# EAGLE design Decoder_relay_4bit_REV.0 (EAGLE 9.6.2)
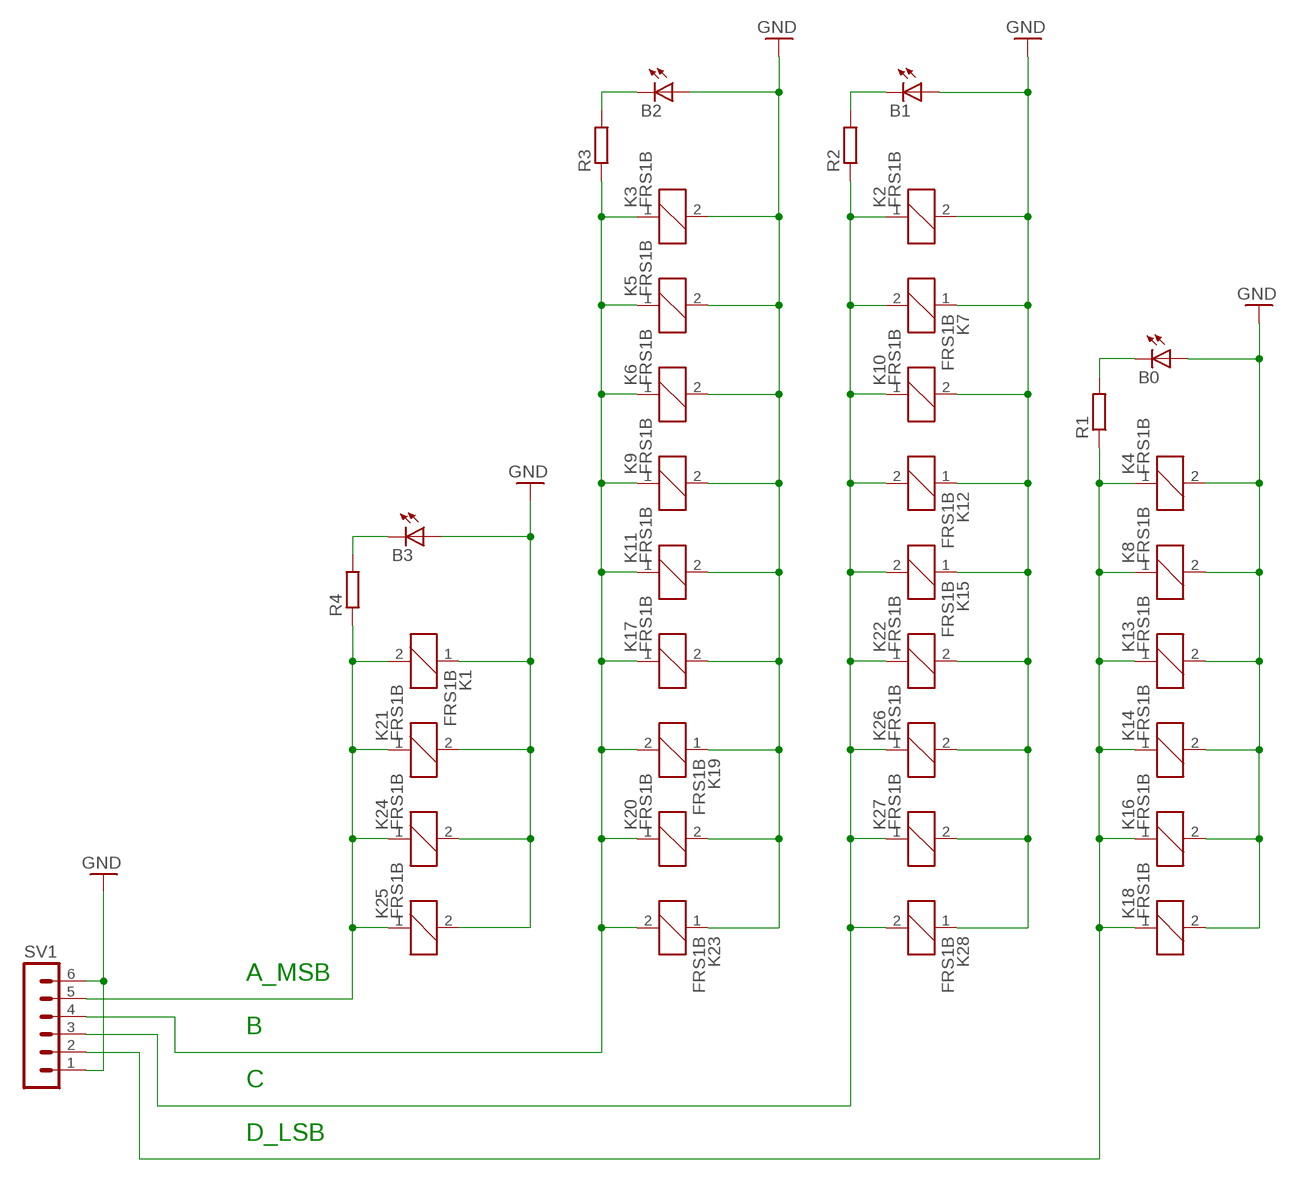
[diagram p0: schematic, sheet 1, part 1 of 2]
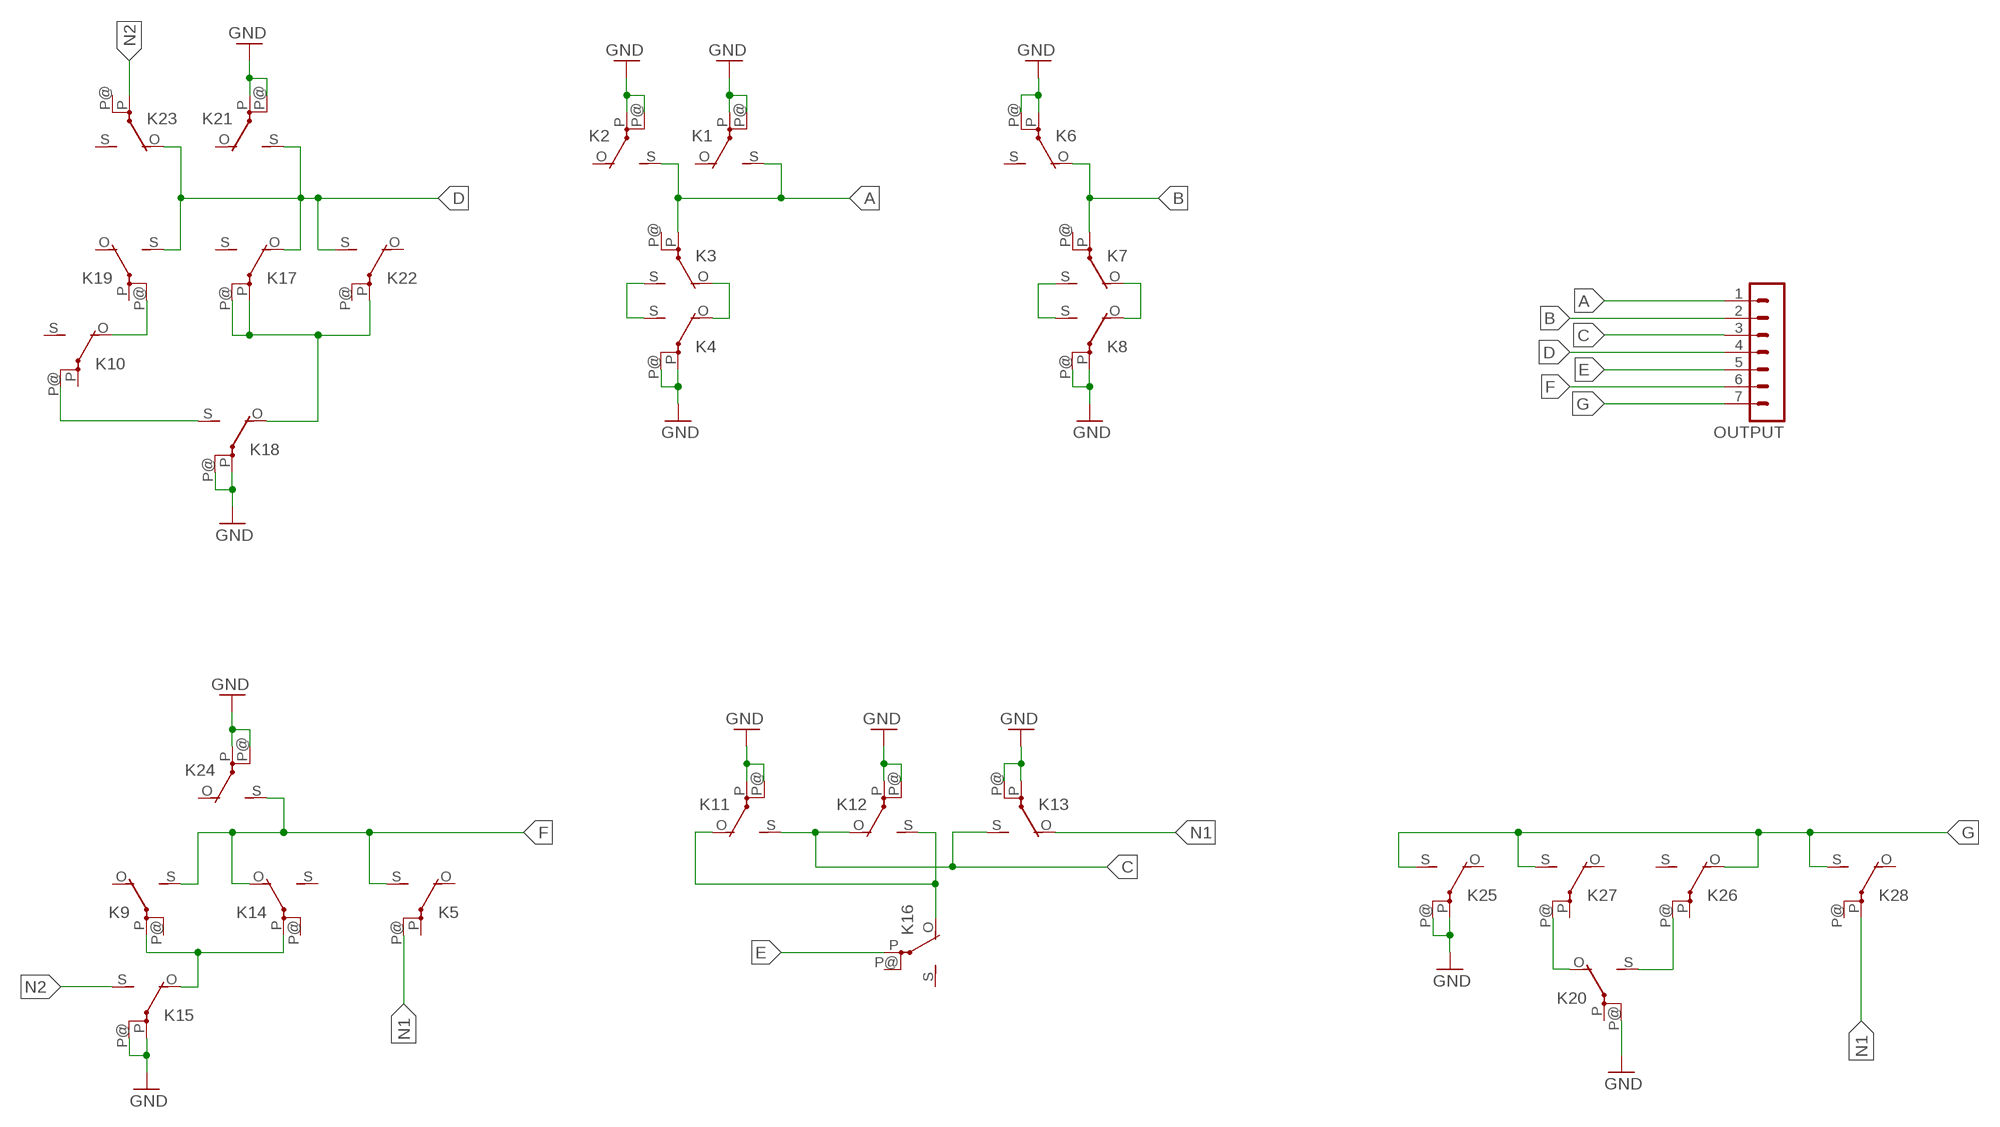
[diagram p1: schematic, sheet 1, part 2 of 2]

## Parts
B0  LED3MM  [LED3MM]
B1  LED3MM  [LED3MM]
B2  LED3MM  [LED3MM]
B3  LED3MM  [LED3MM]
K1  FRS1B  [FRS1B]
K2  FRS1B  [FRS1B]
K3  FRS1B  [FRS1B]
K4  FRS1B  [FRS1B]
K5  FRS1B  [FRS1B]
K6  FRS1B  [FRS1B]
K7  FRS1B  [FRS1B]
K8  FRS1B  [FRS1B]
K9  FRS1B  [FRS1B]
K10  FRS1B  [FRS1B]
K11  FRS1B  [FRS1B]
K12  FRS1B  [FRS1B]
K13  FRS1B  [FRS1B]
K14  FRS1B  [FRS1B]
K15  FRS1B  [FRS1B]
K16  FRS1B  [FRS1B]
K17  FRS1B  [FRS1B]
K18  FRS1B  [FRS1B]
K19  FRS1B  [FRS1B]
K20  FRS1B  [FRS1B]
K21  FRS1B  [FRS1B]
K22  FRS1B  [FRS1B]
K23  FRS1B  [FRS1B]
K24  FRS1B  [FRS1B]
K25  FRS1B  [FRS1B]
K26  FRS1B  [FRS1B]
K27  FRS1B  [FRS1B]
K28  FRS1B  [FRS1B]
OUTPUT  MA07-1  [MA07-1]
R1  R-EU_M1206  [M1206]
R2  R-EU_M1206  [M1206]
R3  R-EU_M1206  [M1206]
R4  R-EU_M1206  [M1206]
SV1  MA06-1  [MA06-1]

## Nets
A: K1.S(2:S) K2.S(2:S) K3.P(2:P) OUTPUT.1
A3: K1.2 K21.1 K24.1 K25.1 R4.1 SV1.5
B: K6.O(2:O) K7.P(2:P) OUTPUT.2
C: K11.S(2:S) K12.O(2:O) K13.S(2:S) OUTPUT.3
D: K17.O(2:O) K19.S(2:S) K21.S(2:S) K22.S(2:S) K23.O(2:O) OUTPUT.4
E: K16.P(2:P) OUTPUT.5
F: K5.S(2:S) K9.S(2:S) K14.O(2:O) K24.S(2:S) OUTPUT.6
G: K25.S(2:S) K26.O(2:O) K27.S(2:S) K28.S(2:S) OUTPUT.7
GND: B0.A B1.A B2.A B3.A K1.1 K1.P(2:P) K1.P@(2:P) K2.2 K2.P(2:P) K2.P@(2:P) K3.2 K4.2 K4.P(2:P) K4.P@(2:P) K5.2 K6.2 K6.P(2:P) K6.P@(2:P) K7.1 K8.2 K8.P(2:P) K8.P@(2:P) K9.2 K10.2 K11.2 K11.P(2:P) K11.P@(2:P) K12.1 K12.P(2:P) K12.P@(2:P) K13.2 K13.P(2:P) K13.P@(2:P) K14.2 K15.1 K15.P(2:P) K15.P@(2:P) K16.2 K17.2 K18.2 K18.P(2:P) K18.P@(2:P) K19.1 K20.2 K20.P@(2:P) K21.2 K21.P(2:P) K21.P@(2:P) K22.2 K23.1 K24.2 K24.P(2:P) K24.P@(2:P) K25.2 K25.P(2:P) K25.P@(2:P) K26.2 K27.2 K28.1 SV1.1 SV1.6
N1: K5.P@(2:P) K13.O(2:O) K28.P(2:P)
N2: K15.S(2:S) K23.P(2:P)
N$2: K17.P(2:P) K17.P@(2:P) K18.O(2:O) K22.P(2:P)
N$3: B0.K(C) R1.2
N$4: K7.S(2:S) K8.S(2:S)
N$5: B1.K(C) R2.2
N$6: K3.S(2:S) K4.S(2:S)
N$8: B2.K(C) R3.2
N$9: B3.K(C) R4.2
N$12: K9.P(2:P) K14.P(2:P) K15.O(2:O)
N$13: K7.O(2:O) K8.O(2:O)
N$15: K20.S(2:S) K26.P@(2:P)
N$16: K20.O(2:O) K27.P@(2:P)
N$17: K10.P@(2:P) K18.S(2:S)
N$19: K10.O(2:O) K19.P@(2:P)
N$26: K3.O(2:O) K4.O(2:O)
N$55: K11.O(2:O) K12.S(2:S) K16.O(2:O)
N$58: K3.1 K5.1 K6.1 K9.1 K11.1 K17.1 K19.2 K20.1 K23.2 R3.1 SV1.4
N$63: K4.1 K8.1 K13.1 K14.1 K16.1 K18.1 R1.1 SV1.2
N$69: K2.1 K7.2 K10.1 K12.2 K15.2 K22.1 K26.1 K27.1 K28.2 R2.1 SV1.3
Unconnected: K1.O(2:O) K2.O(2:O) K3.P@(2:P) K5.O(2:O) K5.P(2:P) K6.S(2:S) K7.P@(2:P) K9.O(2:O) K9.P@(2:P) K10.P(2:P) K10.S(2:S) K14.P@(2:P) K14.S(2:S) K16.P@(2:P) K16.S(2:S) K17.S(2:S) K19.O(2:O) K19.P(2:P) K20.P(2:P) K21.O(2:O) K22.O(2:O) K22.P@(2:P) K23.P@(2:P) K23.S(2:S) K24.O(2:O) K25.O(2:O) K26.P(2:P) K26.S(2:S) K27.O(2:O) K27.P(2:P) K28.O(2:O) K28.P@(2:P)

## Notes on the sheet
- A_MSB
- B
- C
- D_LSB

## Library data of the parts
B0 B1-B3 = led:LED: LED OSRAM: - CHIPLED LG R971, LG N971, LY N971, LG Q971, LY Q971, LO R971, LY R971 LH N974, LH R974 LS Q976, LO Q976, LY Q976 LO Q996 - Hyper CHIPLED LW Q18S LB Q993, LB Q99A, LB R99A - SideLED LS A670, LO A670, LY A670, LG A670, LP A670 LB A673, LV A673, LT A673, LW A673 LH A674 LY A675 LS A676, LA A676, LO A676, LY A676, LW A676 LS A679, LY A679, LG A679 - Hyper Micro SIDELED® LS Y876, LA Y876, LO Y876, LY Y876 LT Y87S - SmartLED LW L88C, LW L88S LB L89C, LB L89S, LG L890 LS L89K, LO L89K, LY L89K LS L896, LA L896, LO L896, LY L896 - TOPLED LS T670, LO T670, LY T670, LG T670, LP T670 LSG T670, LSP T670, LSY T670, LOP T670, LYG T670 LG T671, LOG T671, LSG T671 LB T673, LV T673, LT T673, LW T673 LH T674 LS T676, LA T676, LO T676, LY T676, LB T676, LH T676, LSB T676, LW T676 LB T67C, LV T67C, LT T67C, LS T67K, LO T67K, LY T67K, LW E67C LS E67B, LA E67B, LO E67B, LY E67B, LB E67C, LV E67C, LT E67C LW T67C LS T679, LY T679, LG T679 LS T770, LO T770, LY T770, LG T770, LP T770 LB T773, LV T773, LT T773, LW T773 LH T774 LS E675, LA E675, LY E675, LS T675 LS T776, LA T776, LO T776, LY T776, LB T776 LHGB T686 LT T68C, LB T68C - Hyper Mini TOPLED® LB M676 - Mini TOPLED Santana® LG M470 LS M47K, LO M47K, LY M47K Source: http://www.osram.convergy.de LUXEON: - LUMILED® LXK2-PW12-R00, LXK2-PW12-S00, LXK2-PW14-U00, LXK2-PW14-V00 LXK2-PM12-R00, LXK2-PM12-S00, LXK2-PM14-U00 LXK2-PE12-Q00, LXK2-PE12-R00, LXK2-PE12-S00, LXK2-PE14-T00, LXK2-PE14-U00 LXK2-PB12-K00, LXK2-PB12-L00, LXK2-PB12-M00, LXK2-PB14-N00, LXK2-PB14-P00, LXK2-PB14-Q00 LXK2-PR12-L00, LXK2-PR12-M00, LXK2-PR14-Q00, LXK2-PR14-R00 LXK2-PD12-Q00, LXK2-PD12-R00, LXK2-PD12-S00 LXK2-PH12-R00, LXK2-PH12-S00 LXK2-PL12-P00, LXK2-PL12-Q00, LXK2-PL12-R00 Source: www.luxeon.com KINGBRIGHT: KA-3528ASYC Source: www.kingbright.com
K1-K28 = relay:FRS1B: RELAY 1 x switch, same as V23101-D6-A201, Siemens; OC_FARNELL: unknown; OC_NEWARK: unknown
OUTPUT = con-lstb:MA07-1: PIN HEADER; OC_FARNELL: unknown; OC_NEWARK: unknown
R1-R4 = rcl:R-EU_: RESISTOR, European symbol
SV1 = con-lstb:MA06-1: PIN HEADER; OC_FARNELL: unknown; OC_NEWARK: unknown

## Board
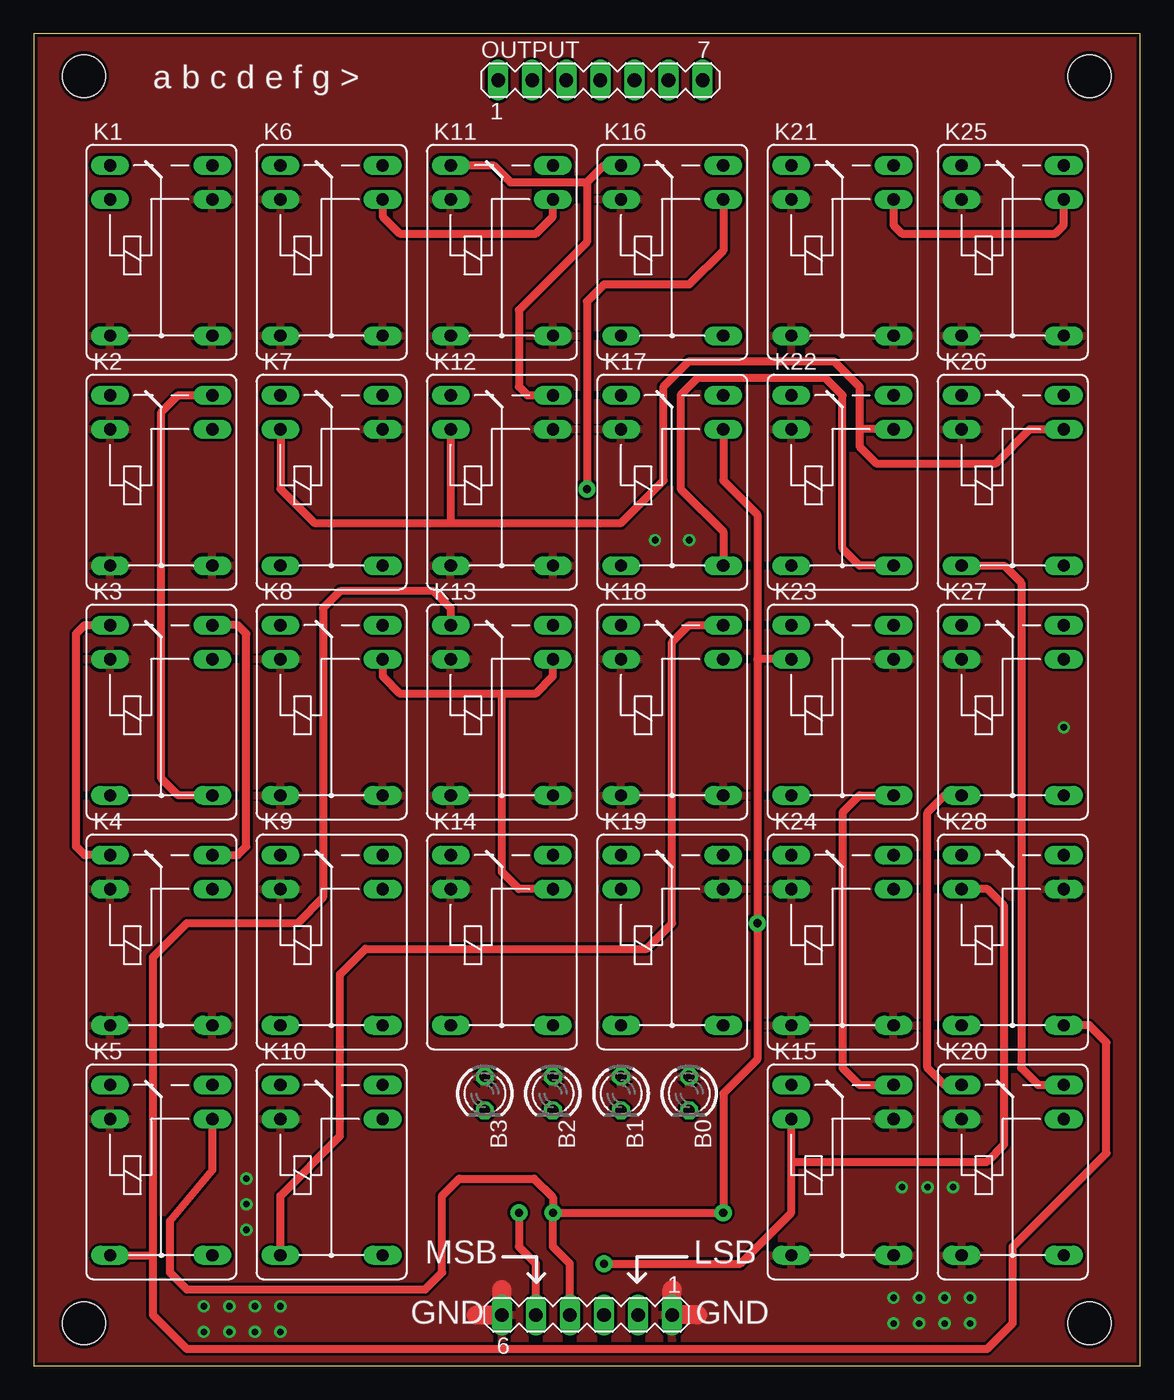
[diagram p2: board, top side]
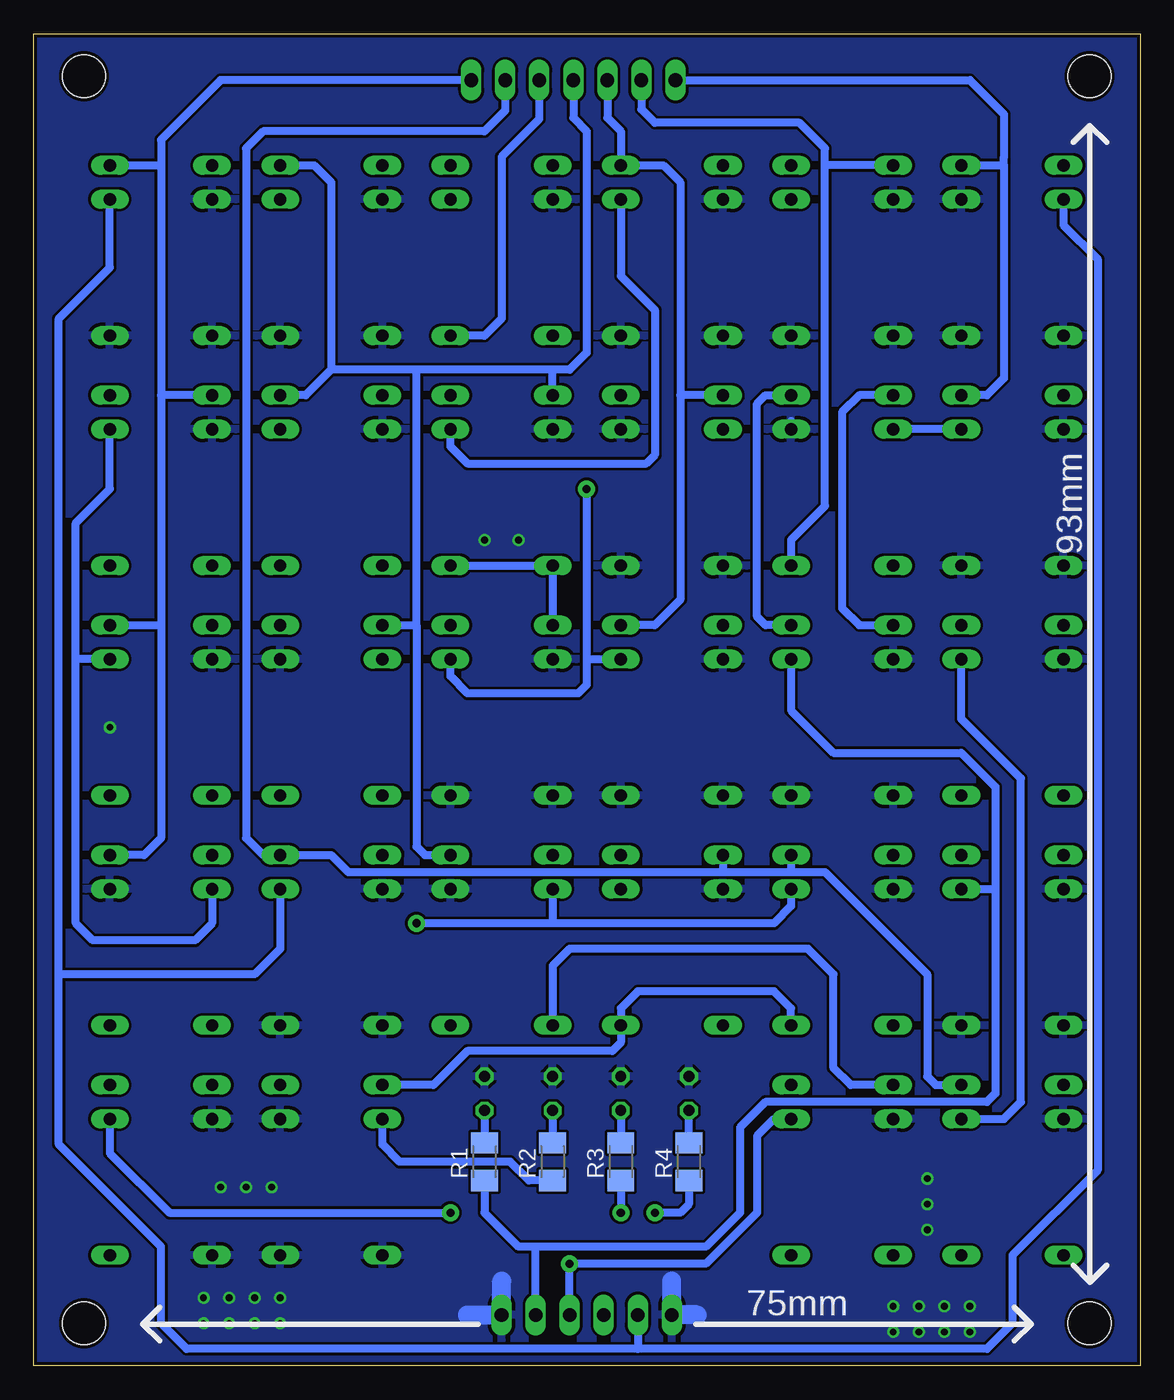
[diagram p3: board, bottom side, seen from below]

Size 82.53 x 99.36 mm. Coordinates in mm from the lower left corner, seen from the top.
Outline: 0,0 82.53,0 82.53,99.36 0,99.36 0,0
Copper layers (1*16): Top 0.035mm / dielectric 1.5mm / Bottom 0.035mm
Design rules "default *": minimum track width 24mil, minimum drill 24mil, track to track 8mil, track to pad 8mil, pad to pad 8mil, via to via 8mil, smd to smd 8mil, copper to edge 10mil, drill to drill 8mil, minimum pad ring 10mil, minimum via ring 8mil, stop-mask expansion 4mil, vias tented up to drill 0mil, thermal gap 10mil
Holes 3.2 mm at 78.77,3.18 78.77,96.18 3.77,3.18 3.77,96.18

### Footprints (pad centres in the part's own frame; a part is rotated, then mirrored left to right if it is on the bottom)
LED3MM = drill 0.813 octagon: A -1.27,0; K 1.27,0
FRS1B = drill 0.914 long: 1 0,3.81; 2 0,-3.81; O -2.54,-3.81; P 10.16,3.81; P@ 10.16,-3.81; S -2.54,3.81
MA07-1 = drill 1.016 long: 1 -7.62,0; 2 -5.08,0; 3 -2.54,0; 4 0,0; 5 2.54,0; 6 5.08,0; 7 7.62,0
M1206 = smd 1.6 x 2: 1 -1.4,0; 2 1.4,0
MA06-1 = drill 1.016 long: 1 -6.35,0; 2 -3.81,0; 3 -1.27,0; 4 1.27,0; 5 3.81,0; 6 6.35,0

### Placement (x,y rotation side)
B0  48.9,20.32 270 top
B1  43.81,20.32 270 top
B2  38.73,20.32 270 top
B3  33.66,20.32 270 top
K1  9.53,87 270 top
K2  9.53,69.85 270 top
K3  9.53,52.7 270 top
K4  9.53,35.56 270 top
K5  9.53,18.41 270 top
K6  22.23,87 270 top
K7  22.23,69.85 270 top
K8  22.23,52.7 270 top
K9  22.23,35.56 270 top
K10  22.23,18.41 270 top
K11  34.92,87 270 top
K12  34.92,69.85 270 top
K13  34.92,52.7 270 top
K14  34.92,35.56 270 top
K15  60.33,18.41 270 top
K16  47.62,87 270 top
K17  47.62,69.85 270 top
K18  47.62,52.7 270 top
K19  47.62,35.56 270 top
K20  73.03,18.41 270 top
K21  60.33,87 270 top
K22  60.33,69.85 270 top
K23  60.33,52.7 270 top
K24  60.33,35.56 270 top
K25  73.03,87 270 top
K26  73.03,69.85 270 top
K27  73.03,52.7 270 top
K28  73.03,35.56 270 top
OUTPUT  42.27,95.89 0 top
R1  48.9,15.24 90 bottom
R2  43.81,15.24 90 bottom
R3  38.73,15.24 90 bottom
R4  33.66,15.24 90 bottom
SV1  41.27,3.81 180 top

### Tracks (layer width: path | path; a pad name or v marks a point on that pad's centre or on a via)
A
  Top 0.61: K3.P 10.79,42.55 9.53,43.81 9.53,71.12 10.79,72.39 K2.S
  Bottom 0.61: OUTPUT.1 12.7,95.89 10.16,93.34 10.16,90.17 10.16,89.53 | 10.16,89.53 10.16,73.66 11.43,72.39 K2.S | K1.S 10.16,89.53
A3  (via drill 0.6 pad 1.27)
  Top 0.61: v36.2,11.43 36.2,8.89 37.47,7.62 SV1.5 | K21.1 64.14,85.09 64.77,84.45 76.2,84.45 76.83,85.09 K25.1
  Bottom 0.61: K1.2 5.71,85.09 3.17,82.55 3.17,14.61 9.53,8.26 9.53,3.17 11.43,1.27 37.47,1.27 | 37.47,1.27 71.12,1.27 73.03,3.17 73.03,8.89 80.64,16.51 80.64,29.21 | 80.64,29.21 80.64,78.11 76.83,81.92 K25.1 | K24.1 64.14,31.11 66.04,29.21 80.64,29.21 | R4.1 33.66,12.06 34.29,11.43 v36.2,11.43 | SV1.5 37.47,1.27
B
  Bottom 0.61: 23.5,89.53 23.5,64.14 26.04,61.59 K7.P | 23.5,89.53 23.5,90.81 25.4,92.71 36.2,92.71 37.2,93.71 OUTPUT.2 | K6.O 23.5,89.53
C
  Bottom 0.61: OUTPUT.3 39.73,93.08 38.73,92.08 K11.S 35.56,89.53 34.29,88.27 34.29,72.39 | 34.29,72.39 34.29,57.15 36.2,55.24 K13.S | K12.O 34.29,72.39
D
  Bottom 0.61: 43.81,74.3 42.55,74.3 41.27,75.56 41.27,92.08 42.27,93.08 OUTPUT.4 | 43.81,74.3 53.98,74.3 | 53.98,74.3 60.33,74.3 | 60.33,74.3 62.23,72.39 K22.S | K21.S 61.59,89.53 60.33,88.27 60.33,74.3 | K17.O 43.81,74.3 | K23.O 53.98,55.24 | 53.98,55.24 53.98,74.3 | 53.98,55.24 53.98,38.73 53.34,38.1 K19.S
E
  Bottom 0.61: OUTPUT.5 44.81,92.98 47.62,90.17 47.62,78.11 48.9,76.83 K16.P
F
  Bottom 0.61: K24.S 65.41,38.1 66.67,39.37 66.67,90.81 65.41,92.08 48.9,92.08 47.35,93.61 OUTPUT.6 | K24.S 63.5,38.1 | K24.S 60.33,38.1 59.05,36.83 31.11,36.83 | 31.11,36.83 26.04,36.83 | 26.04,36.83 23.5,36.83 15.88,29.21 15.88,21.59 15.24,20.95 K5.S | K9.S 26.04,36.83 | K14.O 31.11,36.83
G
  Bottom 0.61: 73.03,89.53 73.03,91.44 68.58,95.89 OUTPUT.7 | 73.03,89.53 73.03,72.39 | 73.03,72.39 73.03,55.24 | 73.03,55.24 73.03,39.37 74.3,38.1 K28.S | K27.S 73.03,55.24 | K26.O 73.03,72.39 | K25.S 73.03,89.53
GND  (via drill 0.5)
  Top 1.422: 33.02,3.81 SV1.6 34.92,5.71 | 49.53,3.81 SV1.1 47.62,5.71
  Bottom 0.61: K7.1 26.04,70.48
  Bottom 1.422: 33.02,3.81 SV1.6 34.92,6.35 | 50.16,3.81 SV1.1 47.62,6.35
  other vias: 12.7,4.45 12.7,2.54 14.61,4.45 16.51,4.45 18.41,4.45 14.61,2.54 16.51,2.54 18.41,2.54 64.14,5.08 66.04,5.08 67.94,5.08 69.85,5.08 64.14,3.17 66.04,3.17 67.94,3.17 69.85,3.17 15.88,10.16 15.88,12.06 15.88,13.97 66.67,13.34 64.77,13.34 68.58,13.34 76.83,47.62 46.35,61.59 48.9,61.59
  pour Top: -2.54,0 82.55,0 82.55,99.06 -2.54,99.06
  pour Bottom: -1.27,0 82.55,0 82.55,99.06 -1.27,99.06
N1
  Top 0.61: 8.89,8.26 8.89,30.48 11.43,33.02 19.68,33.02 21.59,34.92 21.59,56.52 22.86,57.78 29.84,57.78 31.11,56.52 K13.O | 8.89,8.26 8.89,3.81 11.43,1.27 71.12,1.27 73.03,3.17 73.03,8.89 80.01,15.88 80.01,24.13 78.74,25.4 K28.P | K5.P@ 8.89,8.26
N2
  Top 0.61: K15.S 61.59,20.95 60.33,22.23 60.33,41.27 61.59,42.55 K23.P
N$2
  Top 0.61: K22.P 61.59,59.69 60.33,60.96 60.33,72.39 59.05,73.66 49.53,73.66 48.26,72.39 48.26,65.41 51.44,62.23 K17.P
  Bottom 0.61: K17.P K17.P@ K18.O
N$3
  Bottom 0.61: B0.K R1.2
N$4
  Bottom 0.61: K8.S 27.94,55.24 28.57,55.88 28.57,71.75 27.94,72.39 K7.S
N$5
  Bottom 0.61: B1.K R2.2
N$6
  Top 0.61: K4.S 15.24,38.1 15.88,38.73 15.88,54.61 15.24,55.24 K3.S
N$8
  Bottom 0.61: B2.K R3.2
N$9
  Bottom 0.61: R4.2 B3.K
N$12
  Bottom 0.61: K9.P 26.04,26.67 27.3,27.94 37.47,27.94 38.73,26.67 K14.P 38.73,24.13 39.37,23.5 50.16,23.5 52.7,20.95 K15.O
N$13
  Bottom 0.61: K7.O 20.95,72.39 22.23,71.12 22.23,56.52 20.95,55.24 K8.O
N$15
  Top 0.61: K26.P@ 72.39,59.69 73.66,58.42 73.66,22.23 74.93,20.95 K20.S
N$16
  Top 0.61: K20.O 67.94,20.95 66.67,22.23 66.67,41.27 67.94,42.55 K27.P@
N$17
  Top 0.61: K10.P@ 18.41,12.7 22.86,17.14 22.86,29.21 24.77,31.11 45.72,31.11 47.62,33.02 47.62,53.98 48.9,55.24 K18.S
N$19
  Bottom 0.61: K10.O 21.59,20.95 22.86,22.23 22.86,29.21 24.77,31.11 42.55,31.11 43.81,29.84 K19.P@
N$26
  Top 0.61: K4.O 3.81,38.1 3.17,38.73 3.17,54.61 3.81,55.24 K3.O
N$55
  Top 0.61: K11.O 34.29,89.53 35.56,88.27 41.27,88.27 | K16.O 42.55,89.53 41.27,88.27 | 41.27,88.27 41.27,83.82 36.2,78.74 36.2,73.03 36.83,72.39 K12.S
N$58  (via drill 0.6 pad 1.27)
  Top 0.61: K6.1 26.04,85.72 27.3,84.45 37.47,84.45 38.73,85.72 K11.1 | K17.1 51.44,66.04 53.98,63.5 53.98,52.7 | 53.98,52.7 v53.98,33.02 53.98,22.86 51.44,20.32 v51.44,11.43 v38.73,11.43 | K23.2 53.98,52.7 | K5.1 13.34,14.61 10.16,10.79 10.16,6.99 11.43,5.71 29.21,5.71 30.48,6.99 30.48,12.7 31.75,13.97 37.34,13.97 38.73,12.57 v38.73,11.43 | SV1.4 40.01,7.62 38.73,8.89 v38.73,11.43
  Bottom 0.61: K11.1 38.73,81.28 36.2,78.74 36.2,67.94 36.83,67.31 50.16,67.31 51.44,68.58 K17.1 | K5.1 10.16,18.41 8.89,19.68 8.89,43.81 13.34,48.26 K3.1 | K9.1 26.04,34.29 27.3,33.02 43.81,33.02 | 43.81,33.02 v53.98,33.02 | K19.2 43.81,33.02 | R3.1 v38.73,11.43 | K20.1 76.83,15.88 72.39,11.43 v51.44,11.43
N$63  (via drill 0.6 pad 1.27)
  Top 0.61: K8.1 26.04,51.44 27.3,50.16 34.92,50.16 | K14.1 36.2,35.56 34.92,36.83 34.92,50.16 | K16.1 51.44,83.19 48.9,80.64 42.55,80.64 41.27,79.38 v41.27,65.41 | 34.92,50.16 37.47,50.16 38.73,51.44 K13.1
  Bottom 0.61: K8.1 26.04,48.9 22.86,45.72 13.34,45.72 10.79,43.18 10.79,35.56 | 10.79,35.56 10.79,20.32 11.43,19.68 27.94,19.68 29.84,17.78 29.84,11.43 32.38,8.89 45.09,8.89 | K4.1 10.79,35.56 | v41.27,65.41 41.27,52.7 | 41.27,52.7 K13.1 | 41.27,52.7 41.27,50.8 41.91,50.16 50.16,50.16 51.44,51.44 K18.1 | R1.1 48.9,11.43 46.35,8.89 45.09,8.89 | SV1.2 45.09,8.89
N$69  (via drill 0.6 pad 1.27)
  Top 0.61: K7.2 18.41,65.41 20.95,62.87 31.11,62.87 | 31.11,62.87 43.81,62.87 46.99,66.04 46.99,73.03 48.9,74.93 59.69,74.93 61.59,73.03 61.59,69.85 | 61.59,69.85 61.59,68.58 62.87,67.31 71.75,67.31 74.3,69.85 K26.1 | K22.1 61.59,69.85 | K12.2 31.11,62.87 | 56.52,15.24 71.12,15.24 72.39,16.51 72.39,34.29 71.12,35.56 K28.2 | v42.55,7.62 52.7,7.62 56.52,11.43 56.52,15.24 | 56.52,15.24 K15.2
  Bottom 0.61: K28.2 69.22,33.02 70.48,31.75 78.11,31.75 79.38,33.02 79.38,52.7 | 79.38,52.7 79.38,62.87 76.83,65.41 K26.1 | K27.1 79.38,52.7 | K2.1 K7.2 | K10.1 27.3,18.41 28.57,17.14 28.57,11.43 32.38,7.62 v42.55,7.62 SV1.3 | R2.1 45.59,13.84 46.99,15.24 55.24,15.24 56.52,16.51 K15.2

### Text on the board
tPlace: a b c d e f g >
tNames: MSB | LSB | GND | GND
bNames: 93mm | 75mm